# Altium project ch552t.PrjPCB
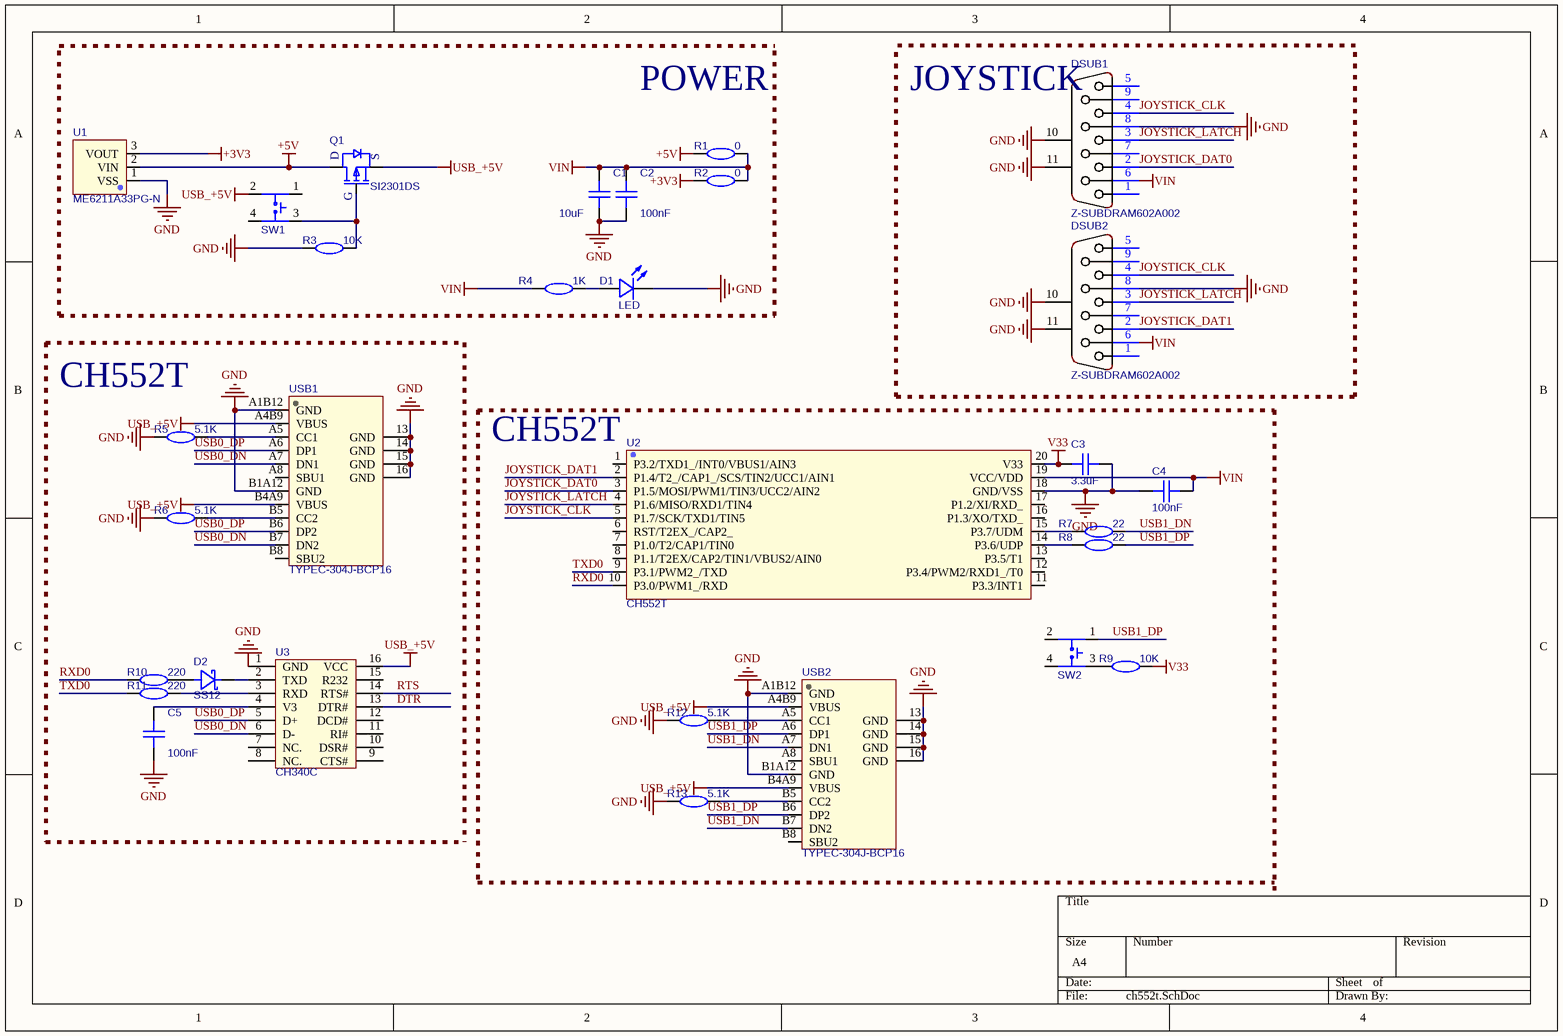
[diagram p0: ch552t.SchDoc]
1 sheet, 30 parts. Net scope: global (net labels, ports and power ports of the same name join across sheets).
Board file: ch552t.PcbDoc

## Sheet ch552t.SchDoc
size A4

### Parts
C1  10uF  [C0603]
C2  100nF  [C0603]
C3  3.3uF  [C0603]
C4  100nF  [C0603]
C5  100nF  [C0603]
D1  LED  [LED-0603]
D2  SS12  [SMA_L4.3-W2.5-LS5.0-RD]
DSUB1  Z-SUBDRAM602A002  [DSUB-TH_Z-SUBDRAM602A002]
DSUB2  Z-SUBDRAM602A002  [DSUB-TH_Z-SUBDRAM602A002]
Q1  SI2301DS  [SOT-23-3_L2.9-W1.3-P1.90-LS2.4-BR]
R1  0  [R0603]
R2  0  [R0603]
R3  10K  [R0603]
R4  1K  [R0603]
R5  5.1K  [R0603]
R6  5.1K  [R0603]
R7  22  [R0603]
R8  22  [R0603]
R9  10K  [R0603]
R10  220  [R0603]
R11  220  [R0603]
R12  5.1K  [R0603]
R13  5.1K  [R0603]
SW1  TS-1071SA-A3B3-D4  [KEY-SMD_4P-L3.5-W3.0-P1.40-LS4.6]  (value not drawn)
SW2  TS-1071SA-A3B3-D4  [KEY-SMD_4P-L3.5-W3.0-P1.40-LS4.6]  (value not drawn)
U1  ME6211A33PG-N  [SOT-89_L4.5-W2.5-P1.50-LS4.2-BR]
U2  CH552T  [TSSOP-20_L6.5-W4.4-P0.65-LS6.4-BL]
U3  CH340C  [SOP-16_L10.0-W3.9-P1.27-LS6.0-BL]
USB1  TYPEC-304J-BCP16  [USB-C-SMD_TYPEC-304J-BCP16]
USB2  TYPEC-304J-BCP16  [USB-C-SMD_TYPEC-304J-BCP16]

### Blocks framed on the sheet
POWER: C1 C2 D1 Q1 R1-R4 SW1 U1
JOYSTICK: DSUB1 DSUB2
CH552T: C5 D2 R5 R6 R10 R11 U3 USB1

### Nets
+3V3: R2.2 U1.3(VOUT)
+5V: Q1.3(D) R1.2 U1.2(VIN)
GND: C1.1 C2.1 C3.1 C4.2 C5.1 D1.2(K) DSUB1.8 DSUB1.10(MH1) DSUB1.11(MH2) DSUB2.8 DSUB2.10(MH1) DSUB2.11(MH2) R3.2 R5.2 R6.2 R12.2 R13.2 U1.1(VSS) U2.18(GND/VSS) U3.1(GND) USB1.13(GND) USB1.14(GND) USB1.15(GND) USB1.16(GND) USB1.A1B12(GND) USB1.B1A12(GND) USB2.13(GND) USB2.14(GND) USB2.15(GND) USB2.16(GND) USB2.A1B12(GND) USB2.B1A12(GND)
USB_+5V: Q1.2(S) SW1.2 U3.16(VCC) USB1.A4B9(VBUS) USB1.B4A9(VBUS) USB2.A4B9(VBUS) USB2.B4A9(VBUS)
V33: C3.2 R9.1 U2.20(V33)
VIN: C1.2 C2.2 C4.1 DSUB1.6 DSUB2.6 R1.1 R2.1 R4.2 U2.19(VCC/VDD)
DTR: U3.13(DTR#)
JOYSTICK_CLK: DSUB1.4 DSUB2.4 U2.5(P1.7/SCK/TXD1/TIN5)
JOYSTICK_DAT0: DSUB1.2 U2.3(P1.5/MOSI/PWM1/TIN3/UCC2/AIN2)
JOYSTICK_DAT1: DSUB2.2 U2.2(P1.4/T2_/CAP1_/SCS/TIN2/UCC1/AIN1)
JOYSTICK_LATCH: DSUB1.3 DSUB2.3 U2.4(P1.6/MISO/RXD1/TIN4)
RTS: U3.14(RTS#)
RXD0: R10.2 U2.10(P3.0/PWM1_/RXD)
TXD0: R11.2 U2.9(P3.1/PWM2_/TXD)
USB0_DN: U3.6(D-) USB1.A7(DN1) USB1.B7(DN2)
USB0_DP: U3.5(D+) USB1.A6(DP1) USB1.B6(DP2)
USB1_DN: R7.1 USB2.A7(DN1) USB2.B7(DN2)
USB1_DP: R8.1 SW2.1 USB2.A6(DP1) USB2.B6(DP2)
NetC5_2: C5.2 U3.4(V3)
NetD1_1: D1.1(A) R4.1
NetD2_1: D2.1 U3.2(TXD)
NetD2_2: D2.2 R10.1
NetQ1_1: Q1.1(G) R3.1 SW1.3
NetR5_1: R5.1 USB1.A5(CC1)
NetR6_1: R6.1 USB1.B5(CC2)
NetR7_2: R7.2 U2.15(P3.7/UDM)
NetR8_2: R8.2 U2.14(P3.6/UDP)
NetR9_2: R9.2 SW2.3
NetR11_1: R11.1 U3.3(RXD)
NetR12_1: R12.1 USB2.A5(CC1)
NetR13_1: R13.1 USB2.B5(CC2)

Not connected (* = marked no-connect by the designer): DSUB1 1 5 7 9; DSUB2 1 5 7 9; SW1 1 4; SW2 2 4; U2 1(P3.2/TXD1_/INT0/VBUS1/AIN3) 6(RST/T2EX_/CAP2_) 7(P1.0/T2/CAP1/TIN0) 8(P1.1/T2EX/CAP2/TIN1/VBUS2/AIN0) 11(P3.3/INT1) 12(P3.4/PWM2/RXD1_/T0) 13(P3.5/T1) 16(P1.3/XO/TXD_) 17(P1.2/XI/RXD_); U3 7(NC.) 8(NC.) 9(CTS#) 10(DSR#) 11(RI#) 12(DCD#) 15(R232); USB1 A8(SBU1) B8(SBU2); USB2 A8(SBU1) B8(SBU2)

### Notes on the sheet
- (near U2) CH552T

### Library data of the parts
C1-C5 = CAP_0603: BOM_Manufacturer: YAGEO; BOM_Manufacturer Part: CC0603GRNPO9BN200; nameAlias: Capacitance; Contributor: LCSC; BOM_Supplier: LCSC; BOM_Supplier Part: C325469; spicePre: C; spiceSymbolName: CC0603GRNPO9BN200
D1 = LED-Y: nameAlias: Model; BOM_Manufacturer Part: ?; spicePre: D; spiceSymbolName: LED
D2 = SS12: C727049; BOM_Manufacturer: TWGMC; Contributor: LCSC; BOM_Supplier: LCSC; BOM_Supplier Part: C727049; BOM_Manufacturer Part: SS12; BOM_JLCPCB Part Class: Extended Part; spicePre: D; spiceSymbolName: SS12_C727049
DSUB1 DSUB2 = Z-SUBDRAM602A002: BOM_Manufacturer: ZHENGLING; Contributor: LCSC; BOM_Supplier: LCSC; BOM_Manufacturer Part: Z-SUBDRAM602A002; BOM_Supplier Part: C115169; BOM_JLCPCB Part Class: Extended Part; spicePre: D; spiceSymbolName: Z-SUBDRAM602A002
Q1 = SI2301DS: BOM_Manufacturer: TECH PUBLIC(台舟); Contributor: LCSC; BOM_Supplier: LCSC; BOM_Supplier Part: C2841444; BOM_Manufacturer Part: SI2301DS; spicePre: Q; spiceSymbolName: SI2301DS
R1-R13 = RES_0603: BOM_Manufacturer: LIZ; BOM_Manufacturer Part: CR0603JA0301G; nameAlias: Resistance (Ohms); BOM_Supplier: LCSC; BOM_Supplier Part: C101323; spicePre: R; spiceSymbolName: CR0603JA0301G
SW1 SW2 = TS-1071SA-A3B3-D4: BOM_Manufacturer: Yuandi; Contributor: LCSC; BOM_Supplier: LCSC; BOM_Supplier Part: C498309; BOM_Manufacturer Part: TS-1071SA-A3B3-D4; BOM_JLCPCB Part Class: Extended Part; spicePre: S; spiceSymbolName: TS-1071SA-A3B3-D4
U1 = ME6211A33PG-N: BOM_Manufacturer: Nanjing Micro One Elec; Contributor: LCSC; BOM_Supplier: LCSC; BOM_Supplier Part: C236673; BOM_Manufacturer Part: ME6211A33PG-N; BOM_JLCPCB Part Class: Extended Part; spicePre: U; spiceSymbolName: ME6211A33PG-N
U2 = CH552T: BOM_Manufacturer: WCH; BOM_Supplier: LCSC; BOM_Manufacturer Part: CH552T; BOM_Supplier Part: C111367; BOM_JLCPCB Part Class: Extended Part; spicePre: U; spiceSymbolName: CH552T
U3 = CH340C: BOM_Manufacturer: WCH; BOM_Supplier: LCSC; BOM_Manufacturer Part: CH340C; BOM_Supplier Part: C84681; BOM_JLCPCB Part Class: Extended Part; spicePre: U; spiceSymbolName: CH340C
USB1 USB2 = TYPEC-304J-BCP16: BOM_Manufacturer: XUNPU(讯普); Contributor: LCSC; BOM_Supplier: LCSC; BOM_Supplier Part: C2835315; BOM_Manufacturer Part: TYPEC-304J-BCP16; BOM_JLCPCB Part Class: Extended Part; spicePre: U; spiceSymbolName: TYPEC-304J-BCP16